# EAGLE schematic AutoGenerated (EAGLE 9.2.2)
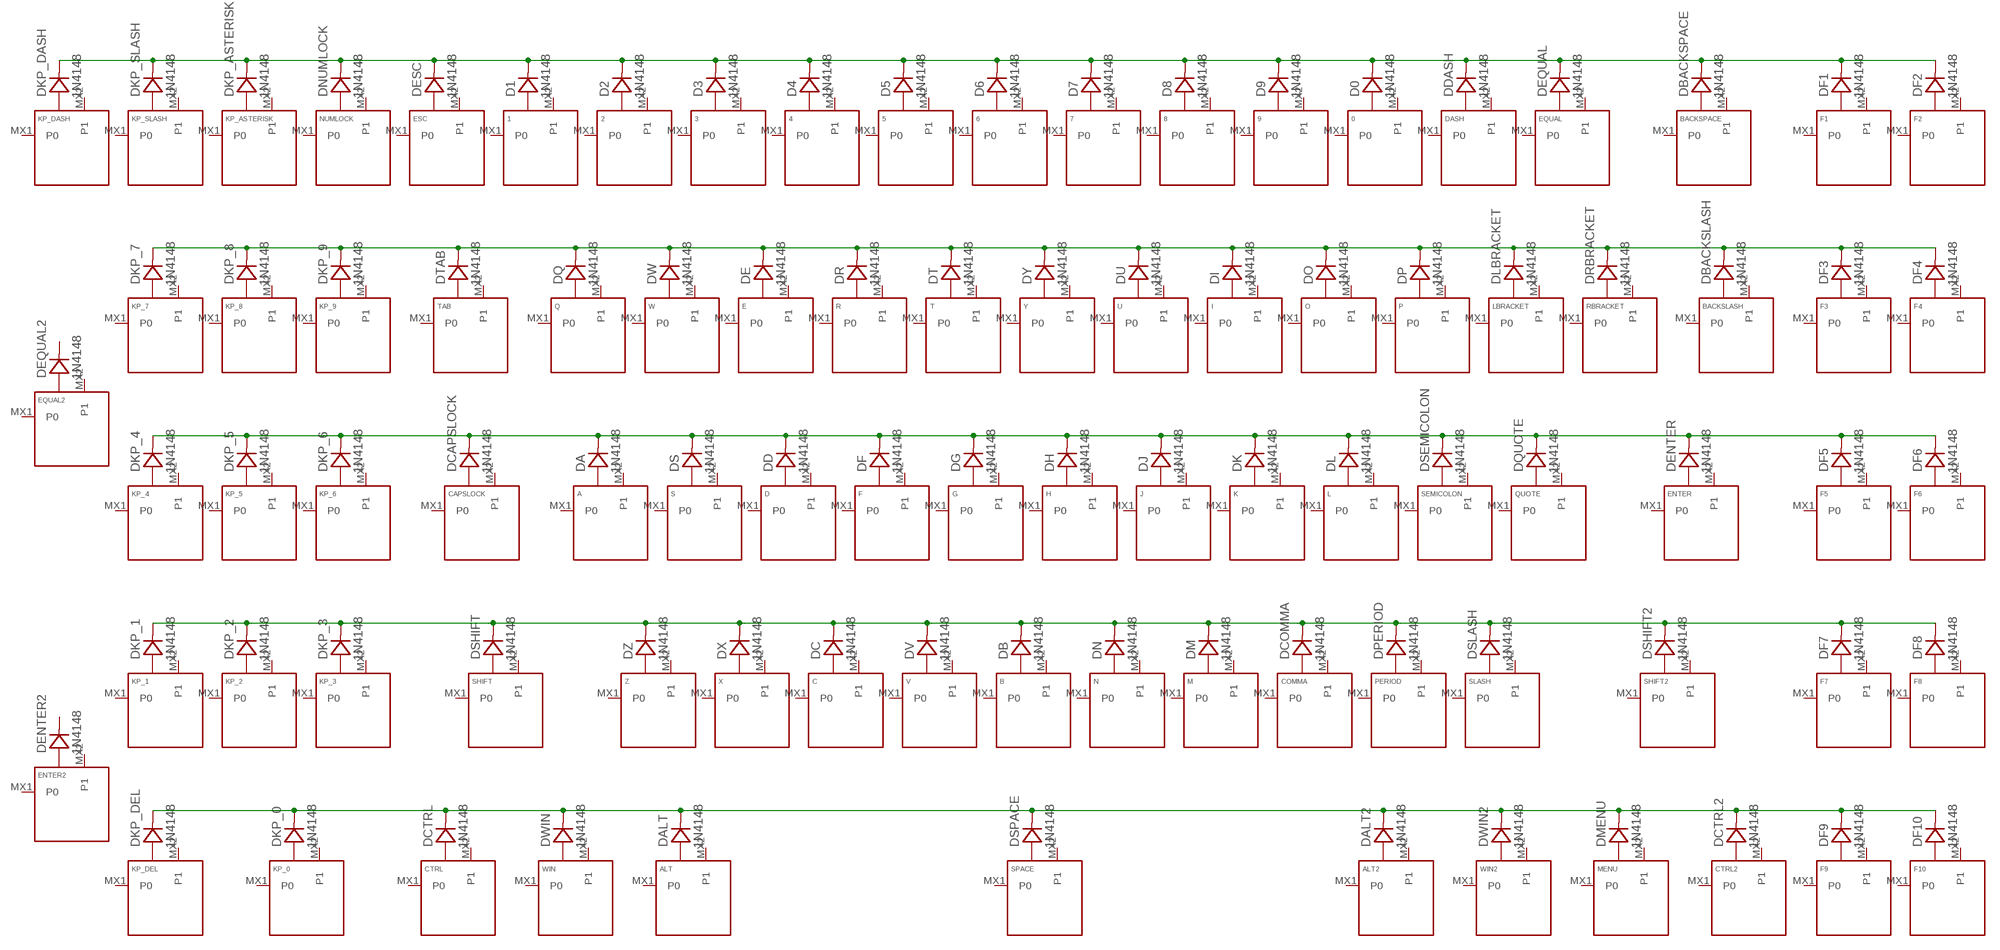
[diagram p0: schematic, sheet 1]

## Parts
0  KEYSWITCH-PLAIN-MX-1U  [MX-1U]
1  KEYSWITCH-PLAIN-MX-1U  [MX-1U]
2  KEYSWITCH-PLAIN-MX-1U  [MX-1U]
3  KEYSWITCH-PLAIN-MX-1U  [MX-1U]
4  KEYSWITCH-PLAIN-MX-1U  [MX-1U]
5  KEYSWITCH-PLAIN-MX-1U  [MX-1U]
6  KEYSWITCH-PLAIN-MX-1U  [MX-1U]
7  KEYSWITCH-PLAIN-MX-1U  [MX-1U]
8  KEYSWITCH-PLAIN-MX-1U  [MX-1U]
9  KEYSWITCH-PLAIN-MX-1U  [MX-1U]
A  KEYSWITCH-PLAIN-MX-1U  [MX-1U]
ALT  KEYSWITCH-PLAIN-MX-1U  [MX-1U]
ALT2  KEYSWITCH-PLAIN-MX-1U  [MX-1U]
B  KEYSWITCH-PLAIN-MX-1U  [MX-1U]
BACKSLASH  KEYSWITCH-PLAIN-MX-1U  [MX-1U]
BACKSPACE  KEYSWITCH-PLAIN-MX-2U  [MX-2U]
C  KEYSWITCH-PLAIN-MX-1U  [MX-1U]
CAPSLOCK  KEYSWITCH-PLAIN-MX-1U  [MX-1U]
COMMA  KEYSWITCH-PLAIN-MX-1U  [MX-1U]
CTRL  KEYSWITCH-PLAIN-MX-1U  [MX-1U]
CTRL2  KEYSWITCH-PLAIN-MX-1U  [MX-1U]
D  KEYSWITCH-PLAIN-MX-1U  [MX-1U]
D0  1N4148  DIODE-DO-35  [DO-35]
D1  1N4148  DIODE-DO-35  [DO-35]
D2  1N4148  DIODE-DO-35  [DO-35]
D3  1N4148  DIODE-DO-35  [DO-35]
D4  1N4148  DIODE-DO-35  [DO-35]
D5  1N4148  DIODE-DO-35  [DO-35]
D6  1N4148  DIODE-DO-35  [DO-35]
D7  1N4148  DIODE-DO-35  [DO-35]
D8  1N4148  DIODE-DO-35  [DO-35]
D9  1N4148  DIODE-DO-35  [DO-35]
DA  1N4148  DIODE-DO-35  [DO-35]
DALT  1N4148  DIODE-DO-35  [DO-35]
DALT2  1N4148  DIODE-DO-35  [DO-35]
DASH  KEYSWITCH-PLAIN-MX-1U  [MX-1U]
DB  1N4148  DIODE-DO-35  [DO-35]
DBACKSLASH  1N4148  DIODE-DO-35  [DO-35]
DBACKSPACE  1N4148  DIODE-DO-35  [DO-35]
DC  1N4148  DIODE-DO-35  [DO-35]
DCAPSLOCK  1N4148  DIODE-DO-35  [DO-35]
DCOMMA  1N4148  DIODE-DO-35  [DO-35]
DCTRL  1N4148  DIODE-DO-35  [DO-35]
DCTRL2  1N4148  DIODE-DO-35  [DO-35]
DD  1N4148  DIODE-DO-35  [DO-35]
DDASH  1N4148  DIODE-DO-35  [DO-35]
DE  1N4148  DIODE-DO-35  [DO-35]
DENTER  1N4148  DIODE-DO-35  [DO-35]
DENTER2  1N4148  DIODE-DO-35  [DO-35]
DEQUAL  1N4148  DIODE-DO-35  [DO-35]
DEQUAL2  1N4148  DIODE-DO-35  [DO-35]
DESC  1N4148  DIODE-DO-35  [DO-35]
DF  1N4148  DIODE-DO-35  [DO-35]
DF1  1N4148  DIODE-DO-35  [DO-35]
DF2  1N4148  DIODE-DO-35  [DO-35]
DF3  1N4148  DIODE-DO-35  [DO-35]
DF4  1N4148  DIODE-DO-35  [DO-35]
DF5  1N4148  DIODE-DO-35  [DO-35]
DF6  1N4148  DIODE-DO-35  [DO-35]
DF7  1N4148  DIODE-DO-35  [DO-35]
DF8  1N4148  DIODE-DO-35  [DO-35]
DF9  1N4148  DIODE-DO-35  [DO-35]
DF10  1N4148  DIODE-DO-35  [DO-35]
DG  1N4148  DIODE-DO-35  [DO-35]
DH  1N4148  DIODE-DO-35  [DO-35]
DI  1N4148  DIODE-DO-35  [DO-35]
DJ  1N4148  DIODE-DO-35  [DO-35]
DK  1N4148  DIODE-DO-35  [DO-35]
DKP_0  1N4148  DIODE-DO-35  [DO-35]
DKP_1  1N4148  DIODE-DO-35  [DO-35]
DKP_2  1N4148  DIODE-DO-35  [DO-35]
DKP_3  1N4148  DIODE-DO-35  [DO-35]
DKP_4  1N4148  DIODE-DO-35  [DO-35]
DKP_5  1N4148  DIODE-DO-35  [DO-35]
DKP_6  1N4148  DIODE-DO-35  [DO-35]
DKP_7  1N4148  DIODE-DO-35  [DO-35]
DKP_8  1N4148  DIODE-DO-35  [DO-35]
DKP_9  1N4148  DIODE-DO-35  [DO-35]
DKP_ASTERISK  1N4148  DIODE-DO-35  [DO-35]
DKP_DASH  1N4148  DIODE-DO-35  [DO-35]
DKP_DEL  1N4148  DIODE-DO-35  [DO-35]
DKP_SLASH  1N4148  DIODE-DO-35  [DO-35]
DL  1N4148  DIODE-DO-35  [DO-35]
DLBRACKET  1N4148  DIODE-DO-35  [DO-35]
DM  1N4148  DIODE-DO-35  [DO-35]
DMENU  1N4148  DIODE-DO-35  [DO-35]
DN  1N4148  DIODE-DO-35  [DO-35]
DNUMLOCK  1N4148  DIODE-DO-35  [DO-35]
DO  1N4148  DIODE-DO-35  [DO-35]
DP  1N4148  DIODE-DO-35  [DO-35]
DPERIOD  1N4148  DIODE-DO-35  [DO-35]
DQ  1N4148  DIODE-DO-35  [DO-35]
DQUOTE  1N4148  DIODE-DO-35  [DO-35]
DR  1N4148  DIODE-DO-35  [DO-35]
DRBRACKET  1N4148  DIODE-DO-35  [DO-35]
DS  1N4148  DIODE-DO-35  [DO-35]
DSEMICOLON  1N4148  DIODE-DO-35  [DO-35]
DSHIFT  1N4148  DIODE-DO-35  [DO-35]
DSHIFT2  1N4148  DIODE-DO-35  [DO-35]
DSLASH  1N4148  DIODE-DO-35  [DO-35]
DSPACE  1N4148  DIODE-DO-35  [DO-35]
DT  1N4148  DIODE-DO-35  [DO-35]
DTAB  1N4148  DIODE-DO-35  [DO-35]
DU  1N4148  DIODE-DO-35  [DO-35]
DV  1N4148  DIODE-DO-35  [DO-35]
DW  1N4148  DIODE-DO-35  [DO-35]
DWIN  1N4148  DIODE-DO-35  [DO-35]
DWIN2  1N4148  DIODE-DO-35  [DO-35]
DX  1N4148  DIODE-DO-35  [DO-35]
DY  1N4148  DIODE-DO-35  [DO-35]
DZ  1N4148  DIODE-DO-35  [DO-35]
E  KEYSWITCH-PLAIN-MX-1U  [MX-1U]
ENTER  KEYSWITCH-PLAIN-MX-2U  [MX-2U]
ENTER2  KEYSWITCH-PLAIN-MX-1U  [MX-1U]
EQUAL  KEYSWITCH-PLAIN-MX-1U  [MX-1U]
EQUAL2  KEYSWITCH-PLAIN-MX-1U  [MX-1U]
ESC  KEYSWITCH-PLAIN-MX-1U  [MX-1U]
F  KEYSWITCH-PLAIN-MX-1U  [MX-1U]
F1  KEYSWITCH-PLAIN-MX-1U  [MX-1U]
F2  KEYSWITCH-PLAIN-MX-1U  [MX-1U]
F3  KEYSWITCH-PLAIN-MX-1U  [MX-1U]
F4  KEYSWITCH-PLAIN-MX-1U  [MX-1U]
F5  KEYSWITCH-PLAIN-MX-1U  [MX-1U]
F6  KEYSWITCH-PLAIN-MX-1U  [MX-1U]
F7  KEYSWITCH-PLAIN-MX-1U  [MX-1U]
F8  KEYSWITCH-PLAIN-MX-1U  [MX-1U]
F9  KEYSWITCH-PLAIN-MX-1U  [MX-1U]
F10  KEYSWITCH-PLAIN-MX-1U  [MX-1U]
G  KEYSWITCH-PLAIN-MX-1U  [MX-1U]
H  KEYSWITCH-PLAIN-MX-1U  [MX-1U]
I  KEYSWITCH-PLAIN-MX-1U  [MX-1U]
J  KEYSWITCH-PLAIN-MX-1U  [MX-1U]
K  KEYSWITCH-PLAIN-MX-1U  [MX-1U]
KP_0  KEYSWITCH-PLAIN-MX-2U  [MX-2U]
KP_1  KEYSWITCH-PLAIN-MX-1U  [MX-1U]
KP_2  KEYSWITCH-PLAIN-MX-1U  [MX-1U]
KP_3  KEYSWITCH-PLAIN-MX-1U  [MX-1U]
KP_4  KEYSWITCH-PLAIN-MX-1U  [MX-1U]
KP_5  KEYSWITCH-PLAIN-MX-1U  [MX-1U]
KP_6  KEYSWITCH-PLAIN-MX-1U  [MX-1U]
KP_7  KEYSWITCH-PLAIN-MX-1U  [MX-1U]
KP_8  KEYSWITCH-PLAIN-MX-1U  [MX-1U]
KP_9  KEYSWITCH-PLAIN-MX-1U  [MX-1U]
KP_ASTERISK  KEYSWITCH-PLAIN-MX-1U  [MX-1U]
KP_DASH  KEYSWITCH-PLAIN-MX-1U  [MX-1U]
KP_DEL  KEYSWITCH-PLAIN-MX-1U  [MX-1U]
KP_SLASH  KEYSWITCH-PLAIN-MX-1U  [MX-1U]
L  KEYSWITCH-PLAIN-MX-1U  [MX-1U]
LBRACKET  KEYSWITCH-PLAIN-MX-1U  [MX-1U]
M  KEYSWITCH-PLAIN-MX-1U  [MX-1U]
MENU  KEYSWITCH-PLAIN-MX-1U  [MX-1U]
N  KEYSWITCH-PLAIN-MX-1U  [MX-1U]
NUMLOCK  KEYSWITCH-PLAIN-MX-1U  [MX-1U]
O  KEYSWITCH-PLAIN-MX-1U  [MX-1U]
P  KEYSWITCH-PLAIN-MX-1U  [MX-1U]
PERIOD  KEYSWITCH-PLAIN-MX-1U  [MX-1U]
Q  KEYSWITCH-PLAIN-MX-1U  [MX-1U]
QUOTE  KEYSWITCH-PLAIN-MX-1U  [MX-1U]
R  KEYSWITCH-PLAIN-MX-1U  [MX-1U]
RBRACKET  KEYSWITCH-PLAIN-MX-1U  [MX-1U]
S  KEYSWITCH-PLAIN-MX-1U  [MX-1U]
SEMICOLON  KEYSWITCH-PLAIN-MX-1U  [MX-1U]
SHIFT  KEYSWITCH-PLAIN-MX-2U  [MX-2U]
SHIFT2  KEYSWITCH-PLAIN-MX-2U  [MX-2U]
SLASH  KEYSWITCH-PLAIN-MX-1U  [MX-1U]
SPACE  KEYSWITCH-PLAIN-MX-6.25U  [MX-6.25U]
T  KEYSWITCH-PLAIN-MX-1U  [MX-1U]
TAB  KEYSWITCH-PLAIN-MX-1U  [MX-1U]
U  KEYSWITCH-PLAIN-MX-1U  [MX-1U]
V  KEYSWITCH-PLAIN-MX-1U  [MX-1U]
W  KEYSWITCH-PLAIN-MX-1U  [MX-1U]
WIN  KEYSWITCH-PLAIN-MX-1U  [MX-1U]
WIN2  KEYSWITCH-PLAIN-MX-1U  [MX-1U]
X  KEYSWITCH-PLAIN-MX-1U  [MX-1U]
Y  KEYSWITCH-PLAIN-MX-1U  [MX-1U]
Z  KEYSWITCH-PLAIN-MX-1U  [MX-1U]

## Nets
ROW1: D0.C D1.C D2.C D3.C D4.C D5.C D6.C D7.C D8.C D9.C DBACKSPACE.C DDASH.C DEQUAL.C DESC.C DF1.C DF2.C DKP_ASTERISK.C DKP_DASH.C DKP_SLASH.C DNUMLOCK.C
ROW2: DBACKSLASH.C DE.C DF3.C DF4.C DI.C DKP_7.C DKP_8.C DKP_9.C DLBRACKET.C DO.C DP.C DQ.C DR.C DRBRACKET.C DT.C DTAB.C DU.C DW.C DY.C
ROW3: DA.C DCAPSLOCK.C DD.C DENTER.C DF5.C DF6.C DF.C DG.C DH.C DJ.C DK.C DKP_4.C DKP_5.C DKP_6.C DL.C DQUOTE.C DS.C DSEMICOLON.C
ROW4: DB.C DC.C DCOMMA.C DF7.C DF8.C DKP_1.C DKP_2.C DKP_3.C DM.C DN.C DPERIOD.C DSHIFT2.C DSHIFT.C DSLASH.C DV.C DX.C DZ.C
ROW5: DALT2.C DALT.C DCTRL2.C DCTRL.C DF9.C DF10.C DKP_0.C DKP_DEL.C DMENU.C DSPACE.C DWIN2.C DWIN.C
Unconnected: 0.MX1(P0) 0.MX2(P1) 1.MX1(P0) 1.MX2(P1) 2.MX1(P0) 2.MX2(P1) 3.MX1(P0) 3.MX2(P1) 4.MX1(P0) 4.MX2(P1) 5.MX1(P0) 5.MX2(P1) 6.MX1(P0) 6.MX2(P1) 7.MX1(P0) 7.MX2(P1) 8.MX1(P0) 8.MX2(P1) 9.MX1(P0) 9.MX2(P1) A.MX1(P0) A.MX2(P1) ALT2.MX1(P0) ALT2.MX2(P1) ALT.MX1(P0) ALT.MX2(P1) B.MX1(P0) B.MX2(P1) BACKSLASH.MX1(P0) BACKSLASH.MX2(P1) BACKSPACE.MX1(P0) BACKSPACE.MX2(P1) C.MX1(P0) C.MX2(P1) CAPSLOCK.MX1(P0) CAPSLOCK.MX2(P1) COMMA.MX1(P0) COMMA.MX2(P1) CTRL2.MX1(P0) CTRL2.MX2(P1) CTRL.MX1(P0) CTRL.MX2(P1) D0.A D1.A D2.A D3.A D4.A D5.A D6.A D7.A D8.A D9.A D.MX1(P0) D.MX2(P1) DA.A DALT2.A DALT.A DASH.MX1(P0) DASH.MX2(P1) DB.A DBACKSLASH.A DBACKSPACE.A DC.A DCAPSLOCK.A DCOMMA.A DCTRL2.A DCTRL.A DD.A DDASH.A DE.A DENTER2.A DENTER2.C DENTER.A DEQUAL2.A DEQUAL2.C DEQUAL.A DESC.A DF1.A DF2.A DF3.A DF4.A DF5.A DF6.A DF7.A DF8.A DF9.A DF10.A DF.A DG.A DH.A DI.A DJ.A DK.A DKP_0.A DKP_1.A DKP_2.A DKP_3.A DKP_4.A DKP_5.A DKP_6.A DKP_7.A DKP_8.A DKP_9.A DKP_ASTERISK.A DKP_DASH.A DKP_DEL.A DKP_SLASH.A DL.A DLBRACKET.A DM.A DMENU.A DN.A DNUMLOCK.A DO.A DP.A DPERIOD.A DQ.A DQUOTE.A DR.A DRBRACKET.A DS.A DSEMICOLON.A DSHIFT2.A DSHIFT.A DSLASH.A DSPACE.A DT.A DTAB.A DU.A DV.A DW.A DWIN2.A DWIN.A DX.A DY.A DZ.A E.MX1(P0) E.MX2(P1) ENTER2.MX1(P0) ENTER2.MX2(P1) ENTER.MX1(P0) ENTER.MX2(P1) EQUAL2.MX1(P0) EQUAL2.MX2(P1) EQUAL.MX1(P0) EQUAL.MX2(P1) ESC.MX1(P0) ESC.MX2(P1) F1.MX1(P0) F1.MX2(P1) F2.MX1(P0) F2.MX2(P1) F3.MX1(P0) F3.MX2(P1) F4.MX1(P0) F4.MX2(P1) F5.MX1(P0) F5.MX2(P1) F6.MX1(P0) F6.MX2(P1) F7.MX1(P0) F7.MX2(P1) F8.MX1(P0) F8.MX2(P1) F9.MX1(P0) F9.MX2(P1) F10.MX1(P0) F10.MX2(P1) F.MX1(P0) F.MX2(P1) G.MX1(P0) G.MX2(P1) H.MX1(P0) H.MX2(P1) I.MX1(P0) I.MX2(P1) J.MX1(P0) J.MX2(P1) K.MX1(P0) K.MX2(P1) KP_0.MX1(P0) KP_0.MX2(P1) KP_1.MX1(P0) KP_1.MX2(P1) KP_2.MX1(P0) KP_2.MX2(P1) KP_3.MX1(P0) KP_3.MX2(P1) KP_4.MX1(P0) KP_4.MX2(P1) KP_5.MX1(P0) KP_5.MX2(P1) KP_6.MX1(P0) KP_6.MX2(P1) KP_7.MX1(P0) KP_7.MX2(P1) KP_8.MX1(P0) KP_8.MX2(P1) KP_9.MX1(P0) KP_9.MX2(P1) KP_ASTERISK.MX1(P0) KP_ASTERISK.MX2(P1) KP_DASH.MX1(P0) KP_DASH.MX2(P1) KP_DEL.MX1(P0) KP_DEL.MX2(P1) KP_SLASH.MX1(P0) KP_SLASH.MX2(P1) L.MX1(P0) L.MX2(P1) LBRACKET.MX1(P0) LBRACKET.MX2(P1) M.MX1(P0) M.MX2(P1) MENU.MX1(P0) MENU.MX2(P1) N.MX1(P0) N.MX2(P1) NUMLOCK.MX1(P0) NUMLOCK.MX2(P1) O.MX1(P0) O.MX2(P1) P.MX1(P0) P.MX2(P1) PERIOD.MX1(P0) PERIOD.MX2(P1) Q.MX1(P0) Q.MX2(P1) QUOTE.MX1(P0) QUOTE.MX2(P1) R.MX1(P0) R.MX2(P1) RBRACKET.MX1(P0) RBRACKET.MX2(P1) S.MX1(P0) S.MX2(P1) SEMICOLON.MX1(P0) SEMICOLON.MX2(P1) SHIFT2.MX1(P0) SHIFT2.MX2(P1) SHIFT.MX1(P0) SHIFT.MX2(P1) SLASH.MX1(P0) SLASH.MX2(P1) SPACE.MX1(P0) SPACE.MX2(P1) T.MX1(P0) T.MX2(P1) TAB.MX1(P0) TAB.MX2(P1) U.MX1(P0) U.MX2(P1) V.MX1(P0) V.MX2(P1) W.MX1(P0) W.MX2(P1) WIN2.MX1(P0) WIN2.MX2(P1) WIN.MX1(P0) WIN.MX2(P1) X.MX1(P0) X.MX2(P1) Y.MX1(P0) Y.MX2(P1) Z.MX1(P0) Z.MX2(P1)

## Library data of the parts
0 1-9 A ALT ALT2 B BACKSLASH BACKSPACE C CAPSLOCK COMMA CTRL CTRL2 D DASH E ENTER ENTER2 EQUAL EQUAL2 ESC F F1-F10 G H I J K KP_0 KP_1-KP_9 KP_ASTERISK KP_DASH KP_DEL KP_SLASH L LBRACKET M MENU N NUMLOCK O P PERIOD Q QUOTE R RBRACKET S SEMICOLON SHIFT SHIFT2 SLASH SPACE T TAB U V W WIN WIN2 X Y Z = Keyboard:KEYSWITCH-PLAIN
D0 D1-D9 DA DALT DALT2 DB DBACKSLASH DBACKSPACE DC DCAPSLOCK DCOMMA DCTRL DCTRL2 DD DDASH DE DENTER DENTER2 DEQUAL DEQUAL2 DESC DF DF1-DF10 DG DH DI DJ DK DKP_0 DKP_1-DKP_9 DKP_ASTERISK DKP_DASH DKP_DEL DKP_SLASH DL DLBRACKET DM DMENU DN DNUMLOCK DO DP DPERIOD DQ DQUOTE DR DRBRACKET DS DSEMICOLON DSHIFT DSHIFT2 DSLASH DSPACE DT DTAB DU DV DW DWIN DWIN2 DX DY DZ = Components:DIODE: Standard 1N4148 diode